# Altium schematic sheet InfoDisplayAudio.SchDoc
size A
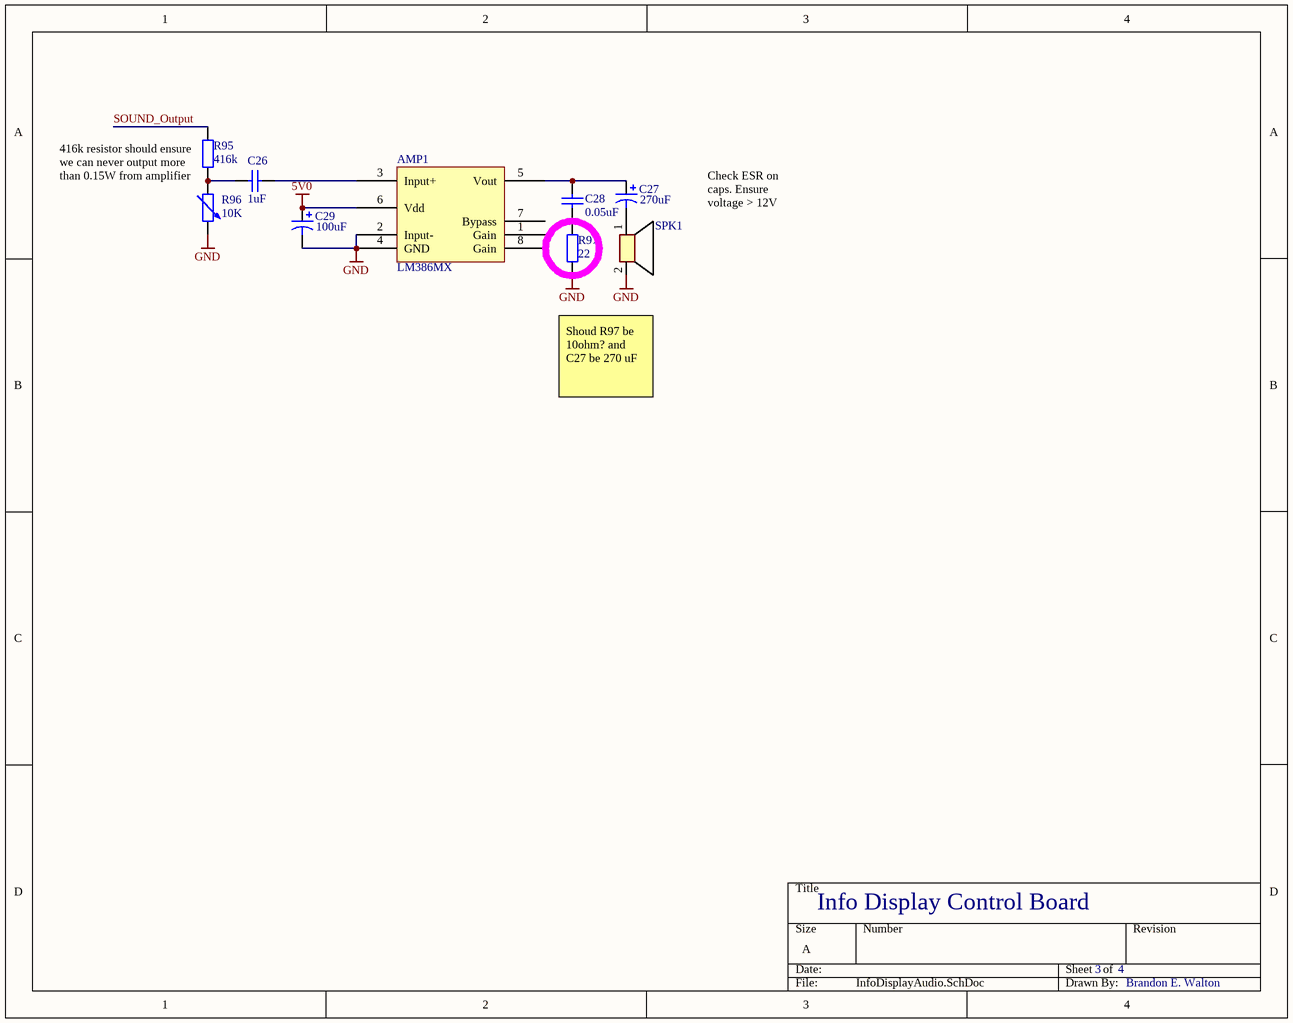
[diagram p0: InfoDisplayAudio.SchDoc]

## Parts
AMP1  LM386MX  [SOIC127P600X173-8N]
C26  value 1uF  [CAPC1005N]  (hidden comment: GRM155R60J105KE19D)
C27  value 270uF  [EEU-FR1A271]  (hidden comment: EEU-FR1A271)
C28  value 0.05uF  [RESC0603N]  (hidden comment: GRM033R61E472KA12D)
C29  value 100uF  [CAPC3216M]  (hidden comment: F930J107MAA)
R95  value 416k  [1608[0603]]  (hidden comment: RC0603FR-07422KL)
R96  value 10K  [PVZ3A103C01R00]  (hidden comment: PVZ3A103C01R00)
R97  value 22  [1608[0603]]  (hidden comment: Res2)
SPK1  PUI AST-03008MR-R  [AST-03008MR-R]  (value not drawn)

## Nets
5V0: AMP1.6(Vdd) C29.1
GND: AMP1.2(Input-) AMP1.4(GND) C29.2 R96.2 R97.2 SPK1.2
SOUND_Output: R95.2
NetAMP1_3: AMP1.3(Input+) C26.2
NetAMP1_5: AMP1.5(Vout) C27.1 C28.2
NetC26_1: C26.1 R95.1 R96.1
NetC27_2: C27.2 SPK1.1
NetC28_1: C28.1 R97.1

Not connected (* = marked no-connect by the designer): AMP1 1(Gain) 7(Bypass) 8(Gain)

## Notes on the sheet
- 416k resistor should ensure we can never output more than 0.15W from amplifier
- Check ESR on caps. Ensure voltage > 12V
- Shoud R97 be 10ohm? and C27 be 270 uF
- Info Display Control Board
- 3
- 4
- Brandon E. Walton

## Library data of the parts
AMP1 = LM386MX: TI Audio Amplifier, 0.350W, 5-12V; Partnumber: LM386MX-1/NOPB; Digikey: LM386MX-1/NOPBCT-ND
C26 C28 = Cap: Capacitor; Published: 8-Jun-2000; LatestRevisionDate: 17-Jul-2002; LatestRevisionNote: Re-released for DXP Platform.; PackageReference: RAD-0.3; Publisher: Altium Limited; PackageDescription: Radial Cap, Thru-Hole; 2 Leads; 0.3 in Pin Spacing
  C26: Digikey: 490-1320-1-ND; PartNumber: GRM155R60J105KE19D
  C28: Digikey: 490-9993-1-ND; PartNumber: GRM033R61E472KA12D
C27 C29 = Cap Pol1: Polarized Capactior; Published: 8-Jun-2000; LatestRevisionDate: 17-Jul-2002; LatestRevisionNote: Re-released for DXP Platform.; PackageReference: RB7.6-15; Publisher: Altium Limited; PackageDescription: Polarized Capacitor (Radial); 2 Leads
  C27: Digikey: P16745-ND; Partnumber: EEU-FR1A271
  C29: Digikey: 478-8155-1-ND; Partnumber: F930J107MAA
R95 = Res2: Resistor; Published: 8-Jun-2000; LatestRevisionDate: 17-Jul-2002; LatestRevisionNote: Re-released for DXP Platform.; PackageReference: AXIAL-0.4; Publisher: Altium Limited; PackageDescription: Axial Device, Thru-Hole; 2 Leads; 0.4 in Pin Spacing; Digikey: 311-422KHRCT-ND; Partnumber: RC0603FR-07422KL
R96 = Res Adj2: Variable Resistor; Set Position: 0.5; Published: 8-Jun-2000; LatestRevisionDate: 17-Jul-2002; LatestRevisionNote: Re-released for DXP Platform.; PackageReference: AXIAL-0.6; Publisher: Altium Limited; PackageDescription: Axial Device, Thru-Hole; 2 Leads; 0.6 in Pin Spacing; Digikey: 490-7005-1-ND; Partnumber: PVZ3A103C01R00
R97 = Res2: Resistor; PartNumber: CRCW120622R0JNEA; Published: 8-Jun-2000; LatestRevisionDate: 17-Jul-2002; LatestRevisionNote: Re-released for DXP Platform.; PackageReference: AXIAL-0.4; Publisher: Altium Limited; PackageDescription: Axial Device, Thru-Hole; 2 Leads; 0.4 in Pin Spacing; Digikey: 541-22ECT-ND
SPK1 = PUI AST-03008MR-R: PUI 0.15W Speaker, 8 Ohm; Digikey: 668-1136-ND; Partnumber: AST-03008MR-R